# EAGLE board OpenBook (EAGLE 9.7.0)
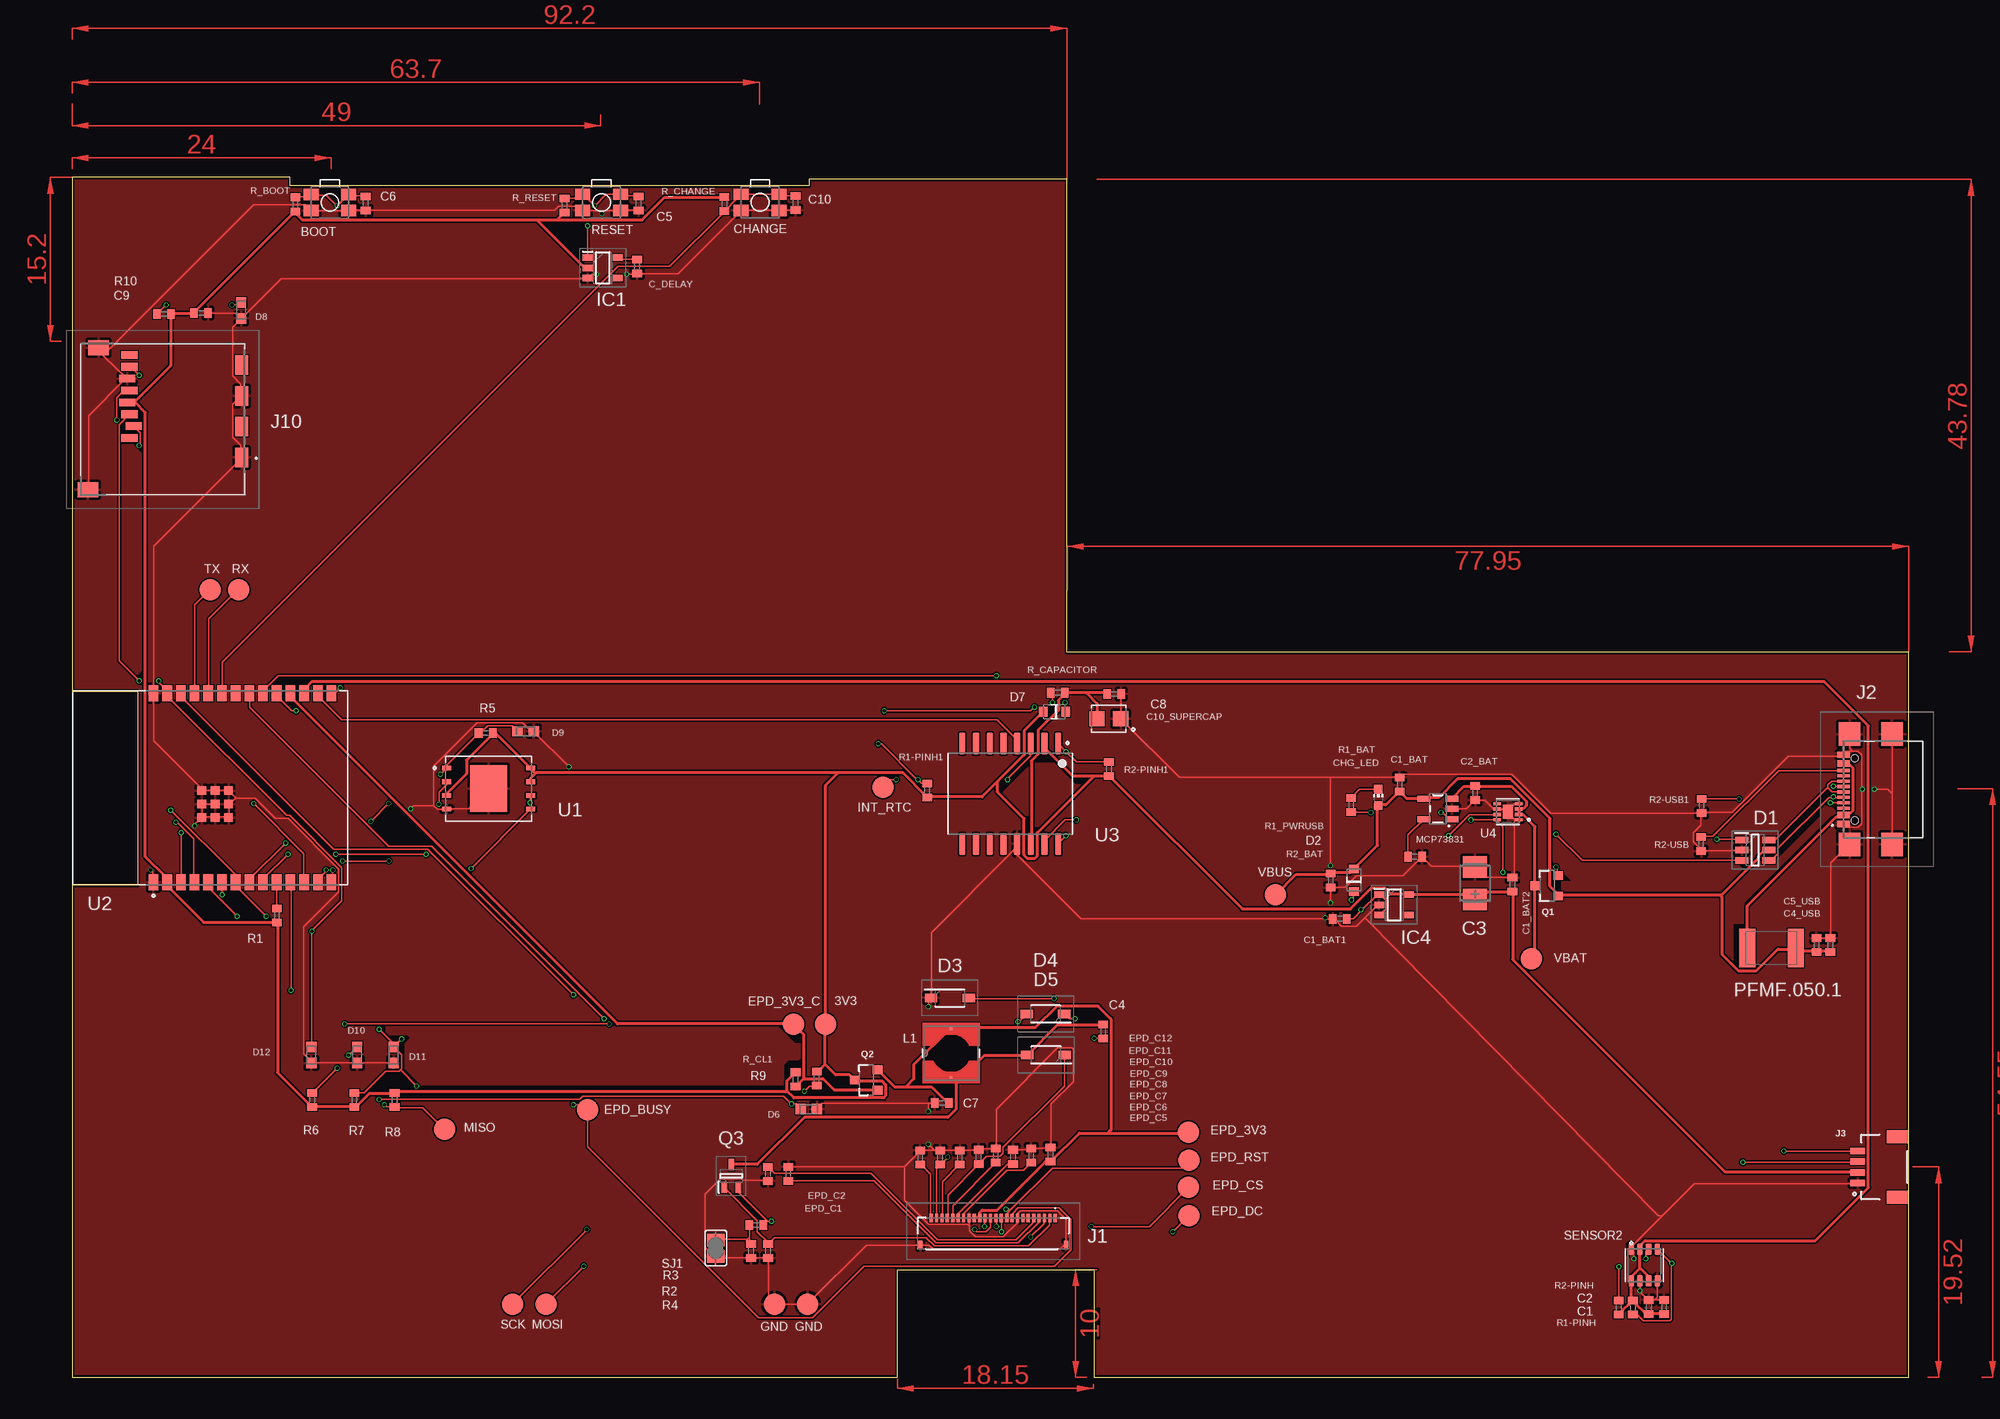
[diagram p1: board, top side]
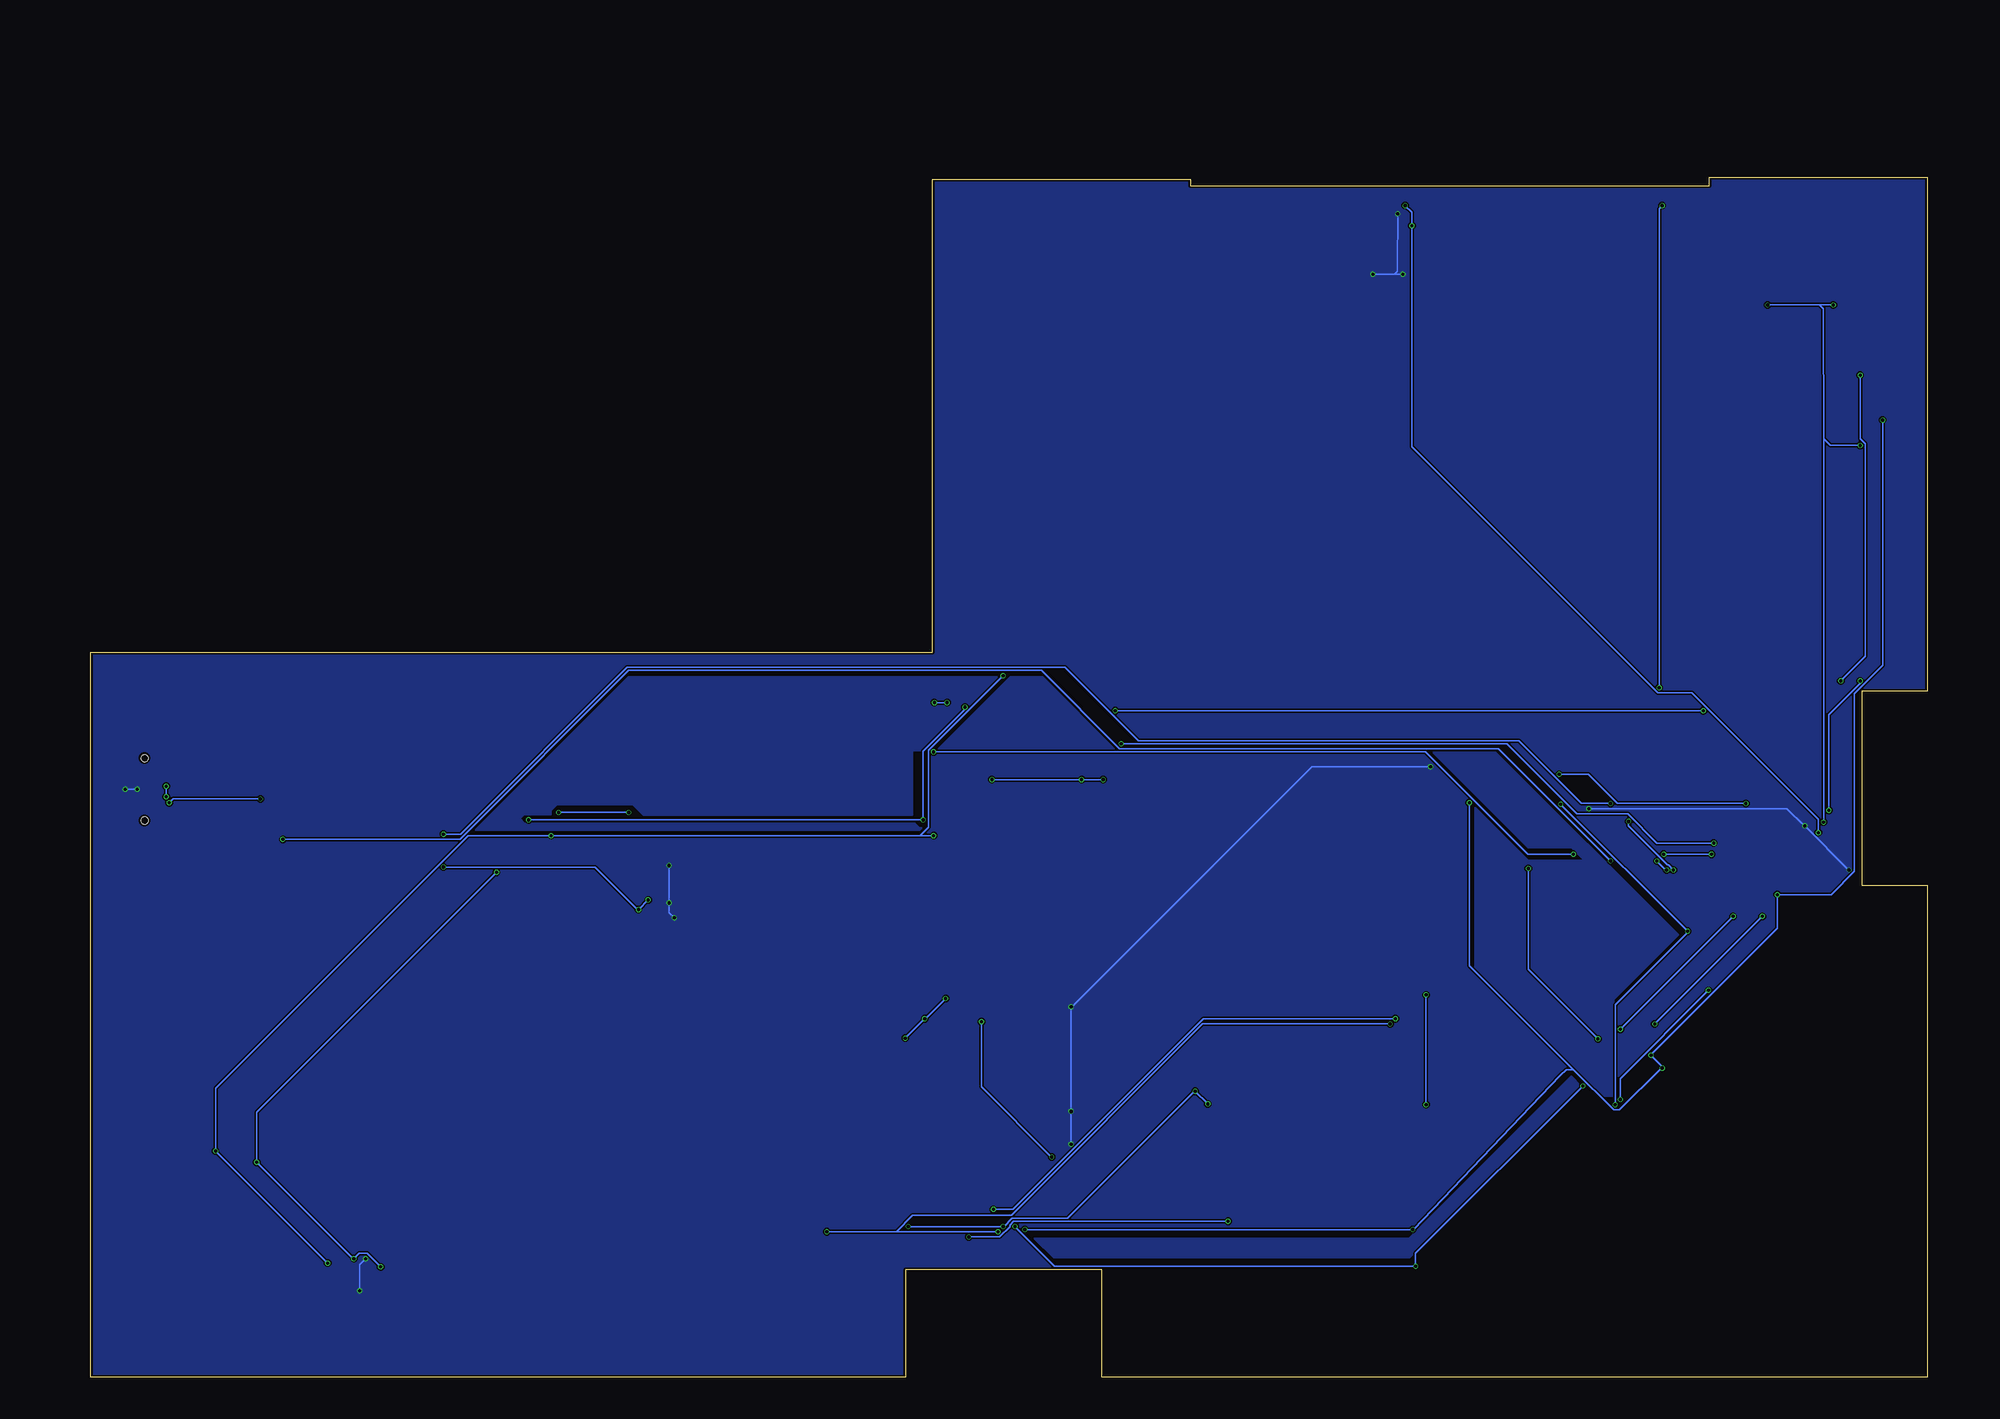
[diagram p2: board, bottom side, seen from below]

Size 170.2 x 111.2 mm. Coordinates in mm from the lower left corner, seen from the top.
Outline: 0,0 76.5,0 76.5,10 94.7,10 94.7,0 170.2,0 170.2,67.2 92.2,67.2 92.2,111 68.3,111 68.3,110.4 20.2,110.4 20.2,111.2 0,111.2 0,63.6 6.1,63.6 6.1,45.6 0,45.6 0,0
Copper layers (1*16): Top 0.035mm / dielectric 1.6mm / Bottom 0.035mm
Design rules "jlcpcb-2layers.dru *": minimum track width 5mil, minimum drill 0.3mm, track to track 5mil, track to pad 5mil, pad to pad 5mil, via to via 5mil, smd to smd 5mil, copper to edge 0.2mm, drill to drill 6mil, minimum pad ring 10mil, minimum via ring 3mil, stop-mask expansion 4mil, vias tented up to drill 0mil, thermal gap 10mil
Net classes: 0 default: width 0.15 mm; 1 power: width 0.3 mm; 2 rest: width 0.15 mm

## Footprints (pad centres in the part's own frame; a part is rotated, then mirrored left to right if it is on the bottom)
MYBUTTON = smd 1.4 x 1.05: 1 1.75,0.75; 2 -1.75,0.75; 3 -1.75,-0.75; 4 1.75,-0.75
EAGLE-LTSPICE_C0402 = smd 0.7 x 0.9: 1 -0.65,0; 2 0.65,0
RCL_CT3528 = smd 2 x 2.2: + -1.5,0; - 1.5,0
CAPCP3225X100N = smd 1.4 x 1.4: 1 -1.1,0; 2 1.1,0
ADAFRUIT_CHIP-LED0603 = smd 0.8 x 0.8: A 0,-0.75; C 0,0.75
SOT95P280X145-6N = smd 1.2 x 0.6: 1 -1.25,0.95; 2 -1.25,0; 3 -1.25,-0.95; 4 1.25,-0.95; 5 1.25,0; 6 1.25,0.95
ESP32_WROVER_AVX---SD0805S020S1R0_AVX_SD0805S020S1R0_0 = smd 0.8 x 0.9: 1 -1.05,0; 2 1.05,0
SOD3716X135N = smd 1.15 x 0.8: 1 -1.75,0; 2 1.75,0
DIOC1608X36N = smd 0.97 x 0.94: 1 -0.75,0; 2 0.75,0
SOT95P280X125-5N = smd 0.9 x 0.6: 1 -1.4,0.95; 2 -1.4,0; 3 -1.4,-0.95; 4 1.4,-0.95; 5 1.4,0.95
SOT95P280X120-5N = smd 0.9 x 0.6: 1 -1.4,0.95; 2 -1.4,0; 3 -1.4,-0.95; 4 1.4,-0.95; 5 1.4,0.95
FH34SRJ24S05SH99 = smd 0.3 x 0.8: 1 5.75,1.45; 2 5.25,1.45; 3 4.75,1.45; 4 4.25,1.45; 5 3.75,1.45; 6 3.25,1.45; 7 2.75,1.45; 8 2.25,1.45; 9 1.75,1.45; 10 1.25,1.45; 11 0.75,1.45; 12 0.25,1.45; 13 -0.25,1.45; 14 -0.75,1.45; 15 -1.25,1.45; 16 -1.75,1.45; 17 -2.25,1.45; 18 -2.75,1.45; 19 -3.25,1.45; 20 -3.75,1.45; 21 -4.25,1.45; 22 -4.75,1.45; 23 -5.25,1.45; 24 -5.75,1.45 | smd 0.4 x 0.8: MP1 6.75,-1.05; MP2 -6.75,-1.05
SAMACSYS_PARTS_USB4110GFA = smd 0.3 x 1.15: A1 -3.35,3.678; A4 -2.55,3.678; A5 -1.25,3.678; A6 -0.25,3.678; A7 0.25,3.678; A8 1.25,3.678; A9 2.55,3.678; A12 3.35,3.678; B1 3.05,3.678; B4 2.25,3.678; B5 1.75,3.678; B6 0.75,3.678; B7 -0.75,3.678; B8 -1.75,3.678; B9 -2.25,3.678; B12 -3.05,3.678 | smd 2.18 x 2: MP1 -5.11,-0.827; MP2 5.11,-0.827; MP3 -5.11,3.103; MP4 5.11,3.103 | hole 0.65: -2.89,2.603; 2.89,2.603
JST04_1MM_RA = smd 0.6 x 1.35: 1 -1.5,0; 2 -0.5,0; 3 0.5,0; 4 1.5,0 | smd 1.2 x 2: NC1 2.8,-3.675; NC2 -2.8,-3.675
112ATAARR03ATTEND = smd 1.8 x 1.2: G1 10.6,10.4; G2 4.9,10.4; S1 7.75,10.4; S2 2.05,10.4 | smd 1.4 x 1.9: G3 13.6,-3.85; G4 0.45,-2.85 | smd 0.7 x 1.5: P1 8.8,0; P2 7.7,0.4; P3 6.6,0; P4 5.5,-0.2; P5 4.4,0; P6 3.3,-0.2; P7 2.2,0; P8 1.1,0
IND_4828-WE-TPC_WRE = smd 0.3 x 0.3: 1 -2.286,0; 2 2.286,0
ESP32_WROVER_SPARKFUN-IC-POWER_SOT23-5 = smd 0.55 x 1.2: 1 -0.95,-1.3; 2 0,-1.3; 3 0.95,-1.3; 4 0.95,1.3; 5 -0.95,1.3
ESP32C6_VARISTOR_CT/CN1812 = smd 1.5 x 3.6: 1 -2.25,0; 2 2.25,0
ESP32_WROVER_SPARKFUN-DISCRETESEMI_SOT23-3 = smd 0.8 x 0.9: 1 -0.95,-1; 2 0.95,-1; 3 0,1.1
SOT65P210X110-3N = smd 1.05 x 0.5: 1 -1.05,0.65; 2 -1.05,-0.65; 3 1.05,0
ESP32_WROVER_EAGLE-LTSPICE_R0402 = smd 0.7 x 0.9: 1 -0.65,0; 2 0.65,0
ESP32_WROVER_BME680_PSON80P300X300X100-8N = smd 1.016 x 0.5: 1 1.458,1.2; 2 1.458,0.4; 3 1.458,-0.4; 4 1.458,-1.2; 5 -1.458,-1.22; 6 -1.458,-0.4; 7 -1.458,0.4; 8 -1.458,1.2
SJ = smd 1.168 x 1.6: 1 -0.762,0; 2 0.762,0
TP20R = smd 2 x 2: TP 0,0
SON127P600X800X80-9N = smd 0.94 x 0.44: 1 -3.895,1.905; 2 -3.895,0.635; 3 -3.895,-0.635; 4 -3.895,-1.905; 5 3.895,-1.905; 6 3.895,-0.635; 7 3.895,0.635; 8 3.895,1.905 | smd 3.4 x 4.3: 9 0,0
XCVR_ESP32-C6-WROOM-1-N8 = smd 1.5 x 0.9: 1 -8.75,5.26; 2 -8.75,3.99; 3 -8.75,2.72; 4 -8.75,1.45; 5 -8.75,0.18; 6 -8.75,-1.09; 7 -8.75,-2.36; 8 -8.75,-3.63; 9 -8.75,-4.9; 10 -8.75,-6.17; 11 -8.75,-7.44; 12 -8.75,-8.71; 13 -8.75,-9.98; 14 -8.75,-11.25; 15 8.75,-11.25; 16 8.75,-9.98; 17 8.75,-8.71; 18 8.75,-7.44; 19 8.75,-6.17; 20 8.75,-4.9; 21 8.75,-3.63; 22 8.75,-2.36; 23 8.75,-1.09; 24 8.75,0.18; 25 8.75,1.45; 26 8.75,2.72; 27 8.75,3.99; 28 8.75,5.26 | smd 0.8 x 0.8: 29_1 -2.755,0.79; 29_2 -1.505,0.79; 29_3 -0.255,0.79; 29_4 -2.755,-0.46; 29_5 -1.505,-0.46; 29_6 -0.255,-0.46; 29_7 -2.755,-1.71; 29_8 -1.505,-1.71; 29_9 -0.255,-1.71
SOIC127P1032X265-16N = smd 2.05 x 0.59: 1 -4.655,4.445; 2 -4.655,3.175; 3 -4.655,1.905; 4 -4.655,0.635; 5 -4.655,-0.635; 6 -4.655,-1.905; 7 -4.655,-3.175; 8 -4.655,-4.445; 9 4.655,-4.445; 10 4.655,-3.175; 11 4.655,-1.905; 12 4.655,-0.635; 13 4.655,0.635; 14 4.655,1.905; 15 4.655,3.175; 16 4.655,4.445
SON50P200X200X80-9N = smd 0.76 x 0.27: 1 -0.985,0.75; 4 -0.985,-0.75; 5 0.985,-0.75; 6 0.985,-0.25; 7 0.985,0.25; 8 0.985,0.75 | smd 0.76 x 0.3: 2 -0.985,0.25; 3 -0.985,-0.25 | smd 0.9 x 1.3: 9 0,0

## Placement (x,y rotation side)
BOOT_BUTTON  BUTTON_CUSYOMV1  [MYBUTTON]  23.9,108.87 180 top
C1  100nF  [EAGLE-LTSPICE_C0402]  147.54,6.53 90 top
C1_BAT  4.7uF  [EAGLE-LTSPICE_C0402]  123.03,54.95 90 top
C1_BAT1  4.7uF  [EAGLE-LTSPICE_C0402]  117.49,42.49 180 top
C1_BAT2  4.7uF  [EAGLE-LTSPICE_C0402]  133.48,45.67 90 top
C2  100nF  [EAGLE-LTSPICE_C0402]  146.12,6.53 90 top
C2_BAT  4.7uF  [EAGLE-LTSPICE_C0402]  130.04,54.15 270 top
C3  100uF TANT  [RCL_CT3528]  130.01,45.8 90 top
C4  4.7uF/25V  [EAGLE-LTSPICE_C0402]  95.56,32.04 90 top
C4_USB  100nF  [EAGLE-LTSPICE_C0402]  162.95,40.07 90 top
C5  1uF  [EAGLE-LTSPICE_C0402]  52.5,108.79 270 top
C5_USB  4.7uF  [EAGLE-LTSPICE_C0402]  161.67,40.07 90 top
C6  100nF  [EAGLE-LTSPICE_C0402]  27.22,108.79 270 top
C7  10uF  [EAGLE-LTSPICE_C0402]  80.59,25.43 180 top
C8  100nF  [EAGLE-LTSPICE_C0402]  96.58,63.33 0 top
C9  100nF  [EAGLE-LTSPICE_C0402]  11.96,98.63 0 top
C10  100nF  [EAGLE-LTSPICE_C0402]  67.05,108.81 270 top
C10_SUPERCAP  CPH3225A  [CAPCP3225X100N]  96.09,61.04 180 top
C_DELAY  100nF  [EAGLE-LTSPICE_C0402]  52.36,102.93 270 top
CHANGE_BUTTON  BUTTON_CUSYOMV1  [MYBUTTON]  63.76,108.89 180 top
CHG_LED  SMD-LED0603  [ADAFRUIT_CHIP-LED0603]  121.06,53.75 0 top
D1  USBLC6-2SC6Y  [SOT95P280X145-6N]  155.98,48.87 0 top
D2  ESP32_WROVER_AVX---SD0805S020S1R0_AVX_SD0805S020S1R0_0_0AVX_SD0805S020S1R0_0_0  [ESP32_WROVER_AVX---SD0805S020S1R0_AVX_SD0805S020S1R0_0]  118.79,46.08 90 top
D3  MBR0530  [SOD3716X135N]  81.36,35.17 0 top
D4  MBR0530  [SOD3716X135N]  90.22,33.68 180 top
D5  MBR0530  [SOD3716X135N]  90.26,29.88 180 top
D6  PGB1010603MR  [DIOC1608X36N]  68.28,24.87 180 top
D7  ESP32_WROVER_AVX---SD0805S020S1R0_AVX_SD0805S020S1R0_0_0AVX_SD0805S020S1R0_0_0  [ESP32_WROVER_AVX---SD0805S020S1R0_AVX_SD0805S020S1R0_0]  91.04,61.68 180 top
D8  PGB1010603MR  [DIOC1608X36N]  15.66,98.87 90 top
D9  PGB1010603MR  [DIOC1608X36N]  42.04,59.87 180 top
D10  PGB1010603MR  [DIOC1608X36N]  26.42,29.87 90 top
D11  PGB1010603MR  [DIOC1608X36N]  29.8,29.87 90 top
D12  PGB1010603MR  [DIOC1608X36N]  22.18,29.87 90 top
EPD_C1  1uF/50V  [EAGLE-LTSPICE_C0402]  66.38,18.87 90 top
EPD_C2  1uF/50V  [EAGLE-LTSPICE_C0402]  64.49,18.87 270 top
EPD_C5  1uF/50V  [EAGLE-LTSPICE_C0402]  90.68,20.65 90 top
EPD_C6  1uF/50V  [EAGLE-LTSPICE_C0402]  88.89,20.55 90 top
EPD_C7  1uF/50V  [EAGLE-LTSPICE_C0402]  87.2,20.45 90 top
EPD_C8  1uF/50V  [EAGLE-LTSPICE_C0402]  85.61,20.55 90 top
EPD_C9  1uF/50V  [EAGLE-LTSPICE_C0402]  84.02,20.45 90 top
EPD_C10  1uF/50V  [EAGLE-LTSPICE_C0402]  82.27,20.39 90 top
EPD_C11  1uF/50V  [EAGLE-LTSPICE_C0402]  80.45,20.39 90 top
EPD_C12  1uF/50V  [EAGLE-LTSPICE_C0402]  78.61,20.39 90 top
IC1  BD5229G-TR  [SOT95P280X125-5N]  49.18,102.81 0 top
IC4  XC6220A331MR-G  [SOT95P280X120-5N]  122.53,43.79 0 top
J1  FH34SRJ-24S-0.5SH_99_  [FH34SRJ24S05SH99]  85.37,13.34 0 top
J2  SAMACSYS_PARTS_USB4110-GF-A  [SAMACSYS_PARTS_USB4110GFA]  167.84,54.5 90 top
J3  QWIIC_RIGHT_ANGLE  [JST04_1MM_RA]  165.49,19.5 90 top
J10  112A-TAAR-R03_ATTEND  [112ATAARR03ATTEND]  5.32,95.85 270 top
L1  68uH  [IND_4828-WE-TPC_WRE]  81.47,30.05 90 top
MCP73831  ESP32_WROVER_SPARKFUN-IC-POWER_MCP73831  [ESP32_WROVER_SPARKFUN-IC-POWER_SOT23-5]  126.58,52.69 90 top
PFMF.050.1  ESP32C6_VARISTORCN1812  [ESP32C6_VARISTOR_CT/CN1812]  157.51,39.8 0 top
Q1  20V/4.2A/52mΩ/1.4W  [ESP32_WROVER_SPARKFUN-DISCRETESEMI_SOT23-3]  136.72,45.56 90 top
Q2  20V/4.2A/52mΩ/1.4W  [ESP32_WROVER_SPARKFUN-DISCRETESEMI_SOT23-3]  73.64,27.56 90 top
Q3  SI1308EDL-T1-GE3  [SOT65P210X110-3N]  61.09,18.68 90 top
R1  10k  [ESP32_WROVER_EAGLE-LTSPICE_R0402]  18.99,42.81 270 top
R1-PINH  10k  [ESP32_WROVER_EAGLE-LTSPICE_R0402]  143.34,6.47 270 top
R1-PINH1  10k  [ESP32_WROVER_EAGLE-LTSPICE_R0402]  79.25,54.39 270 top
R1_BAT  200  [ESP32_WROVER_EAGLE-LTSPICE_R0402]  118.55,53.05 270 top
R1_PWRUSB  100k  [ESP32_WROVER_EAGLE-LTSPICE_R0402]  116.65,46.04 90 top
R2  2.2  [ESP32_WROVER_EAGLE-LTSPICE_R0402]  62.93,11.71 90 top
R2-PINH  10k  [ESP32_WROVER_EAGLE-LTSPICE_R0402]  144.65,6.47 90 top
R2-PINH1  10k  [ESP32_WROVER_EAGLE-LTSPICE_R0402]  96.09,56.39 270 top
R2-USB  5k1  [ESP32_WROVER_EAGLE-LTSPICE_R0402]  150.98,49.43 270 top
R2-USB1  5k1  [ESP32_WROVER_EAGLE-LTSPICE_R0402]  151.02,52.97 90 top
R2_BAT  2k  [ESP32_WROVER_EAGLE-LTSPICE_R0402]  124.46,48.25 180 top
R3  0.47  [ESP32_WROVER_EAGLE-LTSPICE_R0402]  63.41,14.13 0 top
R4  10k  [ESP32_WROVER_EAGLE-LTSPICE_R0402]  64.51,11.71 90 top
R5  10k  [ESP32_WROVER_EAGLE-LTSPICE_R0402]  38.33,59.71 0 top
R6  10k  [ESP32_WROVER_EAGLE-LTSPICE_R0402]  22.25,25.71 270 top
R7  10k  [ESP32_WROVER_EAGLE-LTSPICE_R0402]  26.17,25.71 270 top
R8  10k  [ESP32_WROVER_EAGLE-LTSPICE_R0402]  29.89,25.71 90 top
R9  10k  [ESP32_WROVER_EAGLE-LTSPICE_R0402]  69.01,27.71 90 top
R10  10k  [ESP32_WROVER_EAGLE-LTSPICE_R0402]  8.53,98.53 0 top
R_BOOT  10k  [ESP32_WROVER_EAGLE-LTSPICE_R0402]  20.7,108.7 270 top
R_CAPACITOR  15  [ESP32_WROVER_EAGLE-LTSPICE_R0402]  91.35,63.44 0 top
R_CHANGE  10k  [ESP32_WROVER_EAGLE-LTSPICE_R0402]  60.46,108.71 90 top
R_CL1  10k  [ESP32_WROVER_EAGLE-LTSPICE_R0402]  67.06,27.63 90 top
R_RESET  10k  [ESP32_WROVER_EAGLE-LTSPICE_R0402]  45.64,108.6 270 top
RESET_BUTTON  BUTTON_CUSYOMV1  [MYBUTTON]  49.07,108.88 180 top
SENSOR2  BME688  [ESP32_WROVER_BME680_PSON80P300X300X100-8N]  145.71,10.42 90 top
SJ1  1m  [SJ]  59.66,11.99 90 top
TP1  TPTP20R  [TP20R]  12.8,72.99 0 top
TP2  TPTP20R  [TP20R]  15.43,72.99 0 top
TP3  TPTP20R  [TP20R]  135.25,38.79 0 top
TP4  TPTP20R  [TP20R]  68.17,6.79 0 top
TP5  TPTP20R  [TP20R]  65.09,6.79 0 top
TP6  TPTP20R  [TP20R]  34.51,22.99 0 top
TP7  TPTP20R  [TP20R]  43.93,6.79 0 top
TP8  TPTP20R  [TP20R]  40.85,6.79 0 top
TP9  TPTP20R  [TP20R]  47.77,24.79 0 top
TP10  TPTP20R  [TP20R]  103.48,17.61 0 top
TP11  TPTP20R  [TP20R]  103.49,14.99 0 top
TP12  TPTP20R  [TP20R]  103.53,20.11 0 top
TP13  TPTP20R  [TP20R]  66.88,32.71 0 top
TP14  TPTP20R  [TP20R]  111.53,44.71 0 top
TP15  TPTP20R  [TP20R]  75.18,54.71 0 top
TP16  TPTP20R  [TP20R]  69.83,32.71 0 top
TP17  TPTP20R  [TP20R]  103.48,22.71 0 top
U1  W25Q512JVEIQ  [SON127P600X800X80-9N]  38.61,54.56 0 top
U2  ESP32-C6-WROOM-1-N8  [XCVR_ESP32-C6-WROOM-1-N8]  12.8,54.64 90 top
U3  DS3231SN#  [SOIC127P1032X265-16N]  86.95,54.1 270 top
U4  MAX17048G+T10  [SON50P200X200X80-9N]  133.07,52.42 180 top

## Tracks (layer width: path | path; a pad name or v marks a point on that pad's centre or on a via)
3V3
  Top 0.3: 43.07,107.27 47.51,102.84 47.71,102.84 IC1.2 | 43.07,107.27 45,107.27 | 45,107.27 52.84,107.27 54.91,109.35 60.45,109.35 R_CHANGE.2 | 5.75,90.37 5.12,90.37 J10.P4 | 5.75,90.37 9.14,93.76 9.14,98.4 R10.2 9.21,98.54 11.22,98.54 11.29,98.61 C9.1 11.36,98.75 20.64,108.03 R_BOOT.2 20.71,107.89 21.33,107.27 43.07,107.27 | J3.2 165.44,19.04 153.18,19.04 133.51,38.71 133.51,44.87 C1_BAT2.1 133.44,45.01 130.74,45.01 130.12,44.39 C3.+ 129.98,44.32 129.57,44.74 123.96,44.74 IC4.5 123.82,44.8 122.23,44.8 121.67,45.36 120.43,45.36 118.49,43.42 108.44,43.42 96.19,55.68 R2-PINH1.2 96.05,55.75 94.73,55.75 | R_CL1.2 66.27,27.49 66.27,26.52 | 66.27,26.52 66.89,25.9 75.21,25.9 75.41,26.11 75.41,27.15 75.07,27.49 72.57,27.49 Q2.3 72.44,27.63 72.03,28.03 70.77,28.03 69.8,29 | R9.2 69.04,28.32 69.13,28.32 69.8,29 | 69.8,29 69.8,32.69 TP16.TP 69.83,54.85 71,56.02 | U1.3 34.76,53.95 34.76,54.15 36.56,55.95 36.56,57.2 38.92,59.55 R5.2 38.99,59.69 39.27,59.69 42.45,56.51 U1.8 42.52,56.37 42.87,56.02 43,56.02 | 94.73,55.75 92.73,55.75 90.16,58.31 90.16,58.72 U3.2 | 85.77,55.23 88.22,57.69 88.22,59.9 89.96,61.63 D7.2 | 85.77,55.23 84.35,53.81 79.29,53.81 R1-PINH1.2 79.15,53.88 77.01,56.02 71,56.02 | 94.73,55.75 89.47,50.48 89.47,48.34 89.26,48.13 88.5,48.13 88.22,48.41 88.22,51.78 85.77,54.23 85.77,55.23 | 71,56.02 43,56.02 | 66.27,26.52 66.13,26.45 29.98,26.45 R8.2 29.85,26.32 27.56,26.32 26.32,25.07 R7.2 26.11,25.07 22.3,25.07 R6.2 22.16,25.14 19.04,28.25 19.04,42.03 R1.2 18.97,42.17 12.19,42.17 8.86,45.5 8.86,45.84 U2.2 8.73,45.98 8.73,46.33 6.79,48.27 6.79,89.4 5.89,90.3 5.75,90.37
  Top 0.3: 45,107.27 45,107.31 R_RESET.2 | U1.7 42.51,55.53 43,56.02
32KHZ  (via drill 0.3)
  Top 0.15: 92.14,58 91.41,58.72 U3.1 | 92.14,58 93.07,57.06 96.05,57.06 R2-PINH1.1 | v20.01,48.48 17.73,46.19 17.73,45.91 U2.9 | v32.83,48.48 v24.45,48.48 | v92.1,57.96 92.14,58
  Bottom 0.15: v24.45,48.48 v20.01,48.48 | v32.83,48.48 37.05,48.48 46.54,57.96 v92.1,57.96
DN  (via drill 0.3)
  Top 0.15: 163.22,53.74 162.81,53.74 158.1,49.03 158.1,48.54 157.47,47.92 157.27,47.92 D1.4 | 163.22,53.74 164.12,53.74 J2.B7 | v163.22,54.78 164.12,54.78 J2.A7 | 163.22,53.74 v163.22,53.81
  Bottom 0.15: v163.22,53.81 v163.22,54.78
DP
  Top 0.15: 162.74,54.64 163.08,54.29 164.12,54.29 J2.A6 | 162.74,54.64 162.74,54.91 163.08,55.26 164.12,55.26 J2.B6 | D1.6 157.27,49.86 157.89,49.86 162.67,54.64 162.74,54.64
EPD_3V3
  Top 0.3: 77.27,26.94 76.24,26.94 74.65,28.53 Q2.2 | 77.27,26.94 79.64,26.94 81.09,25.48 81.23,25.48 C7.1 | J1.16 83.65,14.82 84.07,14.82 J1.15 84.14,14.96 84.14,15.3 84.35,15.51 85.73,15.51 90.16,19.94 90.65,19.94 EPD_C5.1 90.79,20.08 93.35,22.64 96,22.64 | 96,22.64 103.46,22.64 TP17.TP | 77.27,26.94 78,27.67 78,29 78.03,29 81.3,32.27 81.44,32.27 L1.2 81.58,32.41 89.26,32.41 91.27,34.42 95.08,34.42 96.25,33.25 96.25,33.19 96.29,33.16 96.29,22.93 96,22.64
EPD_3V3_C
  Top 0.3: 67.8,27.7 67.1,27.01 R_CL1.1 | 67.8,27.7 67.8,31.79 66.89,32.69 TP13.TP 66.76,32.76 50.55,32.76 20.29,63.02 20.29,63.36 U2.18 | 67.8,27.7 69.6,27.7 70.64,26.66 74.58,26.66 Q2.1
EPD_BUSY  (via drill 0.3)
  Top 0.15: J1.9 87.19,14.82 87.19,15.23 87.67,15.72 91.48,15.72 92.59,14.61 92.59,11.84 91.06,10.32 73.41,10.32 68.63,5.54 63.64,5.54 47.78,21.4 47.78,24.72 TP9.TP 47.71,24.79 47.23,25.28 v46.47,25.28 | v46.47,35.46 32.96,48.96 24.24,48.96 10.11,63.09 10.11,63.36 U2.26
  Bottom 0.15: v46.47,25.28 v46.47,35.46
EPD_CS  (via drill 0.3)
  Top 0.15: v85.66,13.99 85.66,14.75 J1.12 | v94.46,13.99 99.86,13.99 TP10.TP | v67.86,26.52 68.35,27.01 68.97,27.01 R9.1 | D6.2 67.52,24.93 67.1,25.35 v66.69,25.35 66.62,25.35 65.93,26.04 47.3,26.04 47.02,25.76 v28.46,25.76 | v20.29,35.87 20.29,45.84 U2.11
  Bottom 0.15: v94.46,13.99 v85.66,13.99 85.59,13.99 84.83,14.75 79.71,14.75 67.93,26.52 v67.86,26.52 v66.69,25.35 | v20.29,35.87 28.46,27.7 v28.46,25.76
EPD_DC  (via drill 0.3)
  Top 0.15: v86.15,13.5 86.15,14.75 J1.11 | v102,13.5 103.46,14.96 TP11.TP | v15.3,42.73 12.67,45.36 12.67,45.84 U2.5 | v49.79,32.76 v25.28,32.76
  Bottom 0.15: v102,13.5 95.58,13.5 95.56,13.5 | 95.56,13.5 v86.15,13.5 | v25.28,32.76 v15.3,42.73 | v49.79,32.76 67.17,32.76 84.9,15.03 94.04,15.03 95.56,13.5
EPD_RST  (via drill 0.3)
  Top 0.15: 87.04,15.57 90.86,19.39 102.84,19.39 103.53,20.08 TP12.TP | 87.04,15.57 86.63,15.17 86.63,14.82 J1.10 | v49.31,33.24 33.31,49.24 29.36,49.24 16.48,62.12 16.48,63.36 U2.21 | v86.56,15.58 87.03,15.58 87.04,15.57
  Bottom 0.15: v49.31,33.24 67.1,33.24 84.76,15.58 v86.56,15.58
FLASH_CS  (via drill 0.3)
  Top 0.15: D9.2 41.27,59.9 40.79,60.39 38.5,60.39 37.88,59.76 37.74,59.76 R5.1 37.67,59.69 34.76,56.78 34.76,56.51 U1.1 34.69,56.44 v34.14,55.88 | v16.83,53.18 21.47,48.54 21.47,45.91 U2.12
  Bottom 0.15: v16.83,53.18 28.74,53.18 31.44,55.88 v34.14,55.88
GDR
  Top 0.15: J1.2 90.58,14.75 90.58,14.13 88.64,12.19 79.92,12.19 79.15,12.95 65.09,12.95 64.54,12.4 R4.2 64.54,12.46 63.5,13.5 63.5,14.54 60.45,17.59 Q3.1
GND  (via drill 0.3)
  Top 0.15: J10.G3 1.52,82.27 1.52,89.12 4.99,92.59 J10.P6 5.05,92.59 4.57,93.07 4.5,93.07 2.49,95.08 2.49,95.36 J10.G4 2.91,94.73 16.83,108.65 21.61,108.65 22.09,108.17 BOOT_BUTTON.1 22.16,108.1 25.62,108.1 BOOT_BUTTON.2 25.69,108.17 27.21,108.17 C6.2 27.29,108.17 44.74,108.17 45.08,108.52 46.95,108.52 47.3,108.17 RESET_BUTTON.1 47.37,108.1 49.1,108.1 | C5.2 52.49,108.17 50.83,108.17 RESET_BUTTON.2 50.76,108.1 49.1,108.1 | U1.9 38.57,54.5 36.77,52.7 34.76,52.7 U1.4 34.69,52.63 33.86,52.63 33.52,52.98 | 33.52,52.98 33.52,56.65 37.53,60.66 41.76,60.66 42.52,59.9 42.73,59.9 D9.1 42.8,59.83 v46.05,56.58 | D11.1 29.78,29.15 26.45,29.15 D10.1 26.38,29.15 22.23,29.15 D12.1 22.23,29.22 21.47,29.98 21.47,41.76 24.72,45.01 24.72,47.09 20.01,51.8 18.84,51.8 16.97,53.67 15.17,53.67 | U2.29_1 12.05,51.94 12.05,53.12 U2.29_2 12.12,53.12 13.23,53.12 U2.29_5 | U2.29_1 12.12,51.94 13.23,51.94 U2.29_4 13.3,51.94 14.47,51.94 U2.29_7 14.54,51.94 14.54,53.12 U2.29_8 14.61,53.12 15.17,53.67 | v7.27,47.02 7.48,46.81 7.48,45.91 U2.1 | v11.36,51.11 11.36,51.24 11.98,51.87 U2.29_1 | 15.17,53.67 15.17,53.74 14.54,54.36 U2.29_9 14.47,54.43 13.3,54.43 U2.29_6 13.23,54.43 12.05,54.43 U2.29_3 12.05,54.5 7.55,59 7.55,63.36 U2.28 7.55,63.43 7.55,77.01 15.72,85.18 J10.G1 15.65,85.32 15.65,86.36 14.89,87.12 14.89,90.16 15.65,90.92 J10.G2 15.65,91 15.65,92.03 14.89,92.8 14.89,97.3 15.65,98.06 D8.1 | 33.52,52.98 31.65,52.98 v31.37,52.7 | C10.2 67.03,108.17 65.51,108.17 CHANGE_BUTTON.2 65.44,108.17 62.05,108.17 CHANGE_BUTTON.1 61.98,108.1 56.16,102.28 52.42,102.28 C_DELAY.2 52.35,102.21 v51.38,102.21
  Top 0.15: C9.2 12.67,98.61 15.17,98.61 D8.1 | D8.1 15.72,98.13 19.39,101.8 47.71,101.8 IC1.3 47.85,101.87 48.2,102.21 v48.61,102.21 | v49.1,107.82 49.1,108.1 | EPD_C2.2 64.47,18.28 62.19,18.28 62.05,18.42 60.11,18.42 58.66,16.97 58.66,12.05 59.42,11.29 59.62,11.29 SJ1.1 59.69,11.22 59.83,11.08 62.88,11.08 R2.1 62.95,11.08 64.47,11.08 R4.1 64.54,11.01 64.54,7.34 65.03,6.86 TP5.TP 68.14,6.79 TP4.TP 68.21,6.86 73.61,12.26 78.6,12.26 J1.MP2 78.67,12.26 79.43,12.26 79.78,11.91 91.62,11.91 92.03,12.33 J1.MP1 92.1,12.33 92.1,14.68 91.34,15.44 87.88,15.44 87.67,15.23 87.67,14.82 J1.8 87.6,14.75 87.6,14.34 86.28,13.02 83.72,13.02 83.17,13.57 83.17,14 | 79.36,25.41 69.53,25.41 69.04,24.93 D6.1 | 79.36,25.41 79.92,25.41 C7.2 | 83.17,14 83.17,14.75 J1.17 | EPD_C7.2 87.25,21.12 88.78,21.12 88.85,21.19 EPD_C6.2 88.92,21.26 90.65,21.26 EPD_C5.2 90.72,21.33 90.72,25.35 92.8,27.42 92.8,30.4 92.66,30.54 91.34,30.54 85.66,24.86 85.66,21.26 EPD_C8.2 85.59,21.19 84.14,21.19 84.07,21.12 EPD_C9.2 84,21.05 82.34,21.05 EPD_C10.2 82.2,21.05 80.47,21.05 EPD_C11.2 80.4,21.05 79.92,21.05 | 77.14,19.53 66.41,19.53 EPD_C1.2 | 77.14,19.53 78.6,20.98 EPD_C12.2 78.67,21.05 79.92,21.05 | 77.14,19.53 77.14,16.41 79.28,14.28 79.3,14.28 79.39,14.19 82.98,14.19 83.17,14 | v79.36,24.65 79.36,25.41 | 168.69,54.1 168.69,59.55 J2.MP2 | 168.69,54.1 168.69,49.44 J2.MP1 | D1.2 154.7,48.82 151.03,48.82 R2-USB.2 151.03,48.89 150.27,49.65 150.27,50.48 150.97,51.18 150.97,52.28 R2-USB1.1 | 164.19,57.82 164.19,57.62 J2.B1 164.12,57.55 159.07,57.55 153.87,52.35 151.03,52.35 R2-USB1.1
  Top 0.15: 164.19,57.82 J2.A12 | C5_USB.2 161.7,40.72 C4_USB.2 163.01,40.79 163.01,47.71 164.68,49.38 J2.MP3 164.68,49.44 164.19,49.93 164.19,50.97 | J2.B12 164.19,51.38 164.19,51.18 J2.A1 164.19,51.11 164.19,50.97 | 165,58.03 165.51,58.03 165.85,57.69 165.85,54.5 | 165.85,54.5 165.85,51.31 165.51,50.97 164.19,50.97 | v165.92,54.5 165.85,54.5 | 116.62,55.61 102.63,55.61 97.23,61.01 C10_SUPERCAP.1 97.23,61.08 97.23,63.29 C8.2 | 116.62,55.61 122.99,55.61 C1_BAT.2 123.06,55.61 123.33,55.88 133.44,55.88 137.05,52.28 150.9,52.28 R2-USB1.1 | 146.7,7.2 147.5,7.2 C1.2 | 146.7,7.2 146.19,7.2 C2.2 146.05,7.2 145.36,7.89 145.36,8.03 | 145.36,8.03 145.36,8.93 SENSOR2.7 | 147.4,14.99 150.34,17.94 165.44,17.94 J3.1 | 147.4,14.99 144.53,12.12 144.53,11.91 SENSOR2.1 144.53,11.84 144.73,11.63 v144.73,11.01 | v145.29,8.03 145.36,8.03 | 133.65,51.73 134,51.73 U4.1 | 133.65,51.73 133.03,52.35 U4.9 | U4.9 132.96,52.35 132.68,52.63 132.13,52.63 U4.6 132.06,52.7 131.71,52.7 130.95,53.46 130.05,53.46 C2_BAT.2 129.98,53.46 129.22,52.7 127.91,52.7 MCP73831.2 | U4.4 134,53.12 133.65,53.12 132.96,52.42 U4.9 | 133.65,51.73 133.65,46.6 133.44,46.4 C1_BAT2.2 133.44,46.33 131.02,46.33 130.05,47.3 C3.- 129.98,47.37 125.97,47.37 125.14,48.2 R2_BAT.1 125.07,48.2 123.33,46.47 119.04,46.47 118,45.43 116.69,45.43 R1_PWRUSB.1 116.62,45.36 v116.62,43.97 | 119.8,42.59 120.98,43.77 121.12,43.77 IC4.2 | 119.8,42.59 119.04,41.83 117.66,41.83 117.03,42.45 116.89,42.45 C1_BAT1.2 116.83,42.52 116.13,42.52 | 87.22,48.79 87.53,49.1 87.53,49.44 U3.13 | 87.22,48.79 79.64,41.2 79.64,35.18 D3.1 79.57,35.11 79.36,34.9 v79.36,34.35
  Top 0.15: 116.13,42.52 93.49,42.52 87.22,48.79 | v116.13,42.59 116.13,42.52 | 119.8,42.59 147,15 147.01,14.99 147.4,14.99 | v116.62,47.44 116.62,55.61 | v79.36,21.61 79.92,21.05 | SENSOR2.5 146.93,7.43 146.7,7.2 | v167.03,54.5 168.29,54.5 168.69,54.1 | J2.MP4 164.73,58.3 165,58.03 | 165,58.03 164.4,58.03 164.19,57.82
  Bottom 0.15: v7.27,47.02 v11.36,51.11 11.43,51.11 13.02,52.7 v31.37,52.7 | v48.61,102.21 49.4,102.21 | 49.4,102.21 v51.38,102.21 | v49.1,107.82 49.1,103 49.1,102.51 49.4,102.21 | v79.36,21.61 v79.36,24.65 v79.36,34.35 79.29,34.35 57.06,56.58 v46.05,56.58 | v165.92,54.5 v167.03,54.5 | v145.29,8.03 145.29,10.46 v144.73,11.01 | v116.13,42.59 116.62,43.07 v116.62,43.97 v116.62,47.44
  pour Top: 6.16,45.56 6.14,45.54 6.12,45.52 0.08,45.52 0.08,0.08 76.42,0.08 76.42,10.02 76.44,10.04 76.46,10.06 76.48,10.08 94.72,10.08 94.74,10.06 94.76,10.04 94.78,10.02 94.78,0.08 170.12,0.08 170.12,67.12 92.18,67.12 92.16,67.14 92.14,67.16 92.12,67.18 92.12,110.92 68.38,110.92 68.38,110.38 68.36,110.36 68.34,110.34 68.32,110.32 20.18,110.32 20.16,110.34 20.14,110.36 20.12,110.38 20.12,111.12 0.08,111.12 0.08,63.68 6.12,63.68 6.14,63.66 6.16,63.64 6.18,63.62 6.18,45.58
  pour Bottom: 6.16,45.56 6.14,45.54 6.12,45.52 0.08,45.52 0.08,0.08 76.42,0.08 76.42,10.02 76.44,10.04 76.46,10.06 76.48,10.08 94.72,10.08 94.74,10.06 94.76,10.04 94.78,10.02 94.78,0.08 170.12,0.08 170.12,67.12 92.18,67.12 92.16,67.14 92.14,67.16 92.12,67.18 92.12,110.92 68.38,110.92 68.38,110.38 68.36,110.36 68.34,110.34 68.32,110.32 20.18,110.32 20.16,110.34 20.14,110.36 20.12,110.38 20.12,111.12 0.08,111.12 0.08,63.68 6.12,63.68 6.14,63.66 6.16,63.64 6.18,63.62 6.18,45.58
  pour Bottom: 29.06,35.04 29.08,35.02 29.08,26.08 29.97,26.08 41.92,38.03 41.92,52.82 37.04,47.94 37.02,47.92 31.98,47.92 31.96,47.94 31.94,47.96 31.92,47.98 31.92,48.02 31.94,48.04 32.96,49.06 32.98,49.08 36.97,49.08 45.82,57.92 40.03,57.92 23.11,41
  pour Bottom: 80.97,11.08 82.82,12.92 47.98,12.92 47.96,12.94 33,27.89 32.11,27 48.03,11.08
  pour Bottom: 75.18,58.08 91.82,58.08 84.97,64.92 82.03,64.92
  pour Bottom: 93.88,51.34 93.47,50.94 93.45,50.92 93.18,50.92 93.42,50.69 134.6,50.69 120.36,64.92 86.18,64.92 93.03,58.08 94.02,58.08 94.04,58.06 94.06,58.04 94.08,58.02 94.08,52.08 118.97,52.08 119.96,53.06 119.98,53.08 127.02,53.08 127.04,53.06 127.54,52.56 127.56,52.54 127.56,52.16 130.1,52.16 130.12,52.14 130.43,51.83 130.45,51.81 130.45,51.77 130.43,51.75 130.04,51.36 130.02,51.34
  pour Top: 4.66,66.49 6.02,65.13 6.46,65.57 6.46,85.55 5.61,86.4 4.66,86.4
  pour Top: 25.55,52.72 16,62.27 16,62.26 11.52,62.26 11.52,62.19 24.51,49.2 25.54,49.2 25.55,49.21
  pour Top: 28.92,53.97 21.97,60.92 20.77,60.92 20.75,60.94 19.32,62.36 17.07,62.36 17.08,62.03 27.03,52.08 27.97,52.08 28.92,53.03
  pour Top: 31.32,31.37 31.3,31.35 30.86,30.9 30.86,28.67 32.41,27.12 65.92,27.12 65.92,29.02 65.94,29.04 66.34,29.44 66.36,29.46 67.27,29.46 67.45,29.64 67.45,30.92 66.98,30.92 66.96,30.94 65.39,32.5 29.1,32.5 29.1,32.05 29.38,31.77 31.13,31.77 31.15,31.75 31.3,31.6 31.32,31.58
  pour Top: 89.97,51.08 93.82,54.92 92.98,54.92 92.96,54.94 90.97,56.92 89.08,56.92 89.08,51.08
  pour Top: 88.03,52.08 88.92,52.08 88.92,56.82 86.11,54
  pour Top: 139.06,45.96 139.04,45.94 139.02,45.92 138.08,45.92 138.08,45.08 152.97,45.08 154.89,47 153.97,47.92 139.98,47.92 139.96,47.94 137.97,49.92 137.08,49.92 137.08,48.03 139.06,46.04 139.08,46.02 139.08,45.98
  pour Top: 162.06,51.96 158.04,47.94 158.02,47.92 156.03,47.92 153.08,44.97 153.08,39.03 153.92,38.18 153.92,42.02 153.94,42.04 153.96,42.06 153.98,42.08 154.92,42.08 154.92,44.02 154.94,44.04 162.96,52.06 162.98,52.08 163.82,52.08 162.97,52.92 162.08,52.92 162.08,51.98
GPIO8
  Top 0.15: R1.1 18.97,43.49 18.97,45.84 U2.10
I2C_PW
  Top 0.3: C1.1 147.5,5.89 146.19,5.89 C2.1 145.98,5.89 145.84,5.89 144.73,6.99 R2-PINH.2 | R1-PINH.2 143.35,5.89 144.59,7.13 R2-PINH.2 | R2-PINH.2 144.53,7.27 144.53,8.93 SENSOR2.8 144.59,9.07 144.59,9.42 145.29,10.11 | 145.29,10.11 145.29,11.84 SENSOR2.2 145.43,11.98 145.43,12.33 145.77,12.67 161.56,12.67 166.48,17.59 166.48,60.39 162.39,64.47 22.23,64.47 21.54,63.78 21.54,63.43 U2.17 | SENSOR2.6 146.05,9 146.05,9.42 145.43,10.04 145.29,10.11
INT_RTC  (via drill 0.3)
  Top 0.15: v76.38,55.4 75.83,55.4 75.21,54.78 TP15.TP | R1-PINH1.1 79.22,55.05 78.74,55.05 v78.39,55.4 78.32,55.4 75,58.72 v74.72,58.72 | v19.8,49.51 16.48,46.19 16.48,45.91 U2.8 | v86.7,55.4 86.7,55.47 88.85,57.62 88.85,58.72 U3.3
  Bottom 0.15: v76.38,55.4 v78.39,55.4 v86.7,55.4 | v19.8,49.51 25.07,49.51 27.77,52.22 32.48,52.22 38.99,58.72 v74.72,58.72
IO/BOOT  (via drill 0.3)
  Top 0.15: R_BOOT.1 20.71,109.42 21.95,109.42 22.09,109.55 BOOT_BUTTON.4 22.16,109.55 23.55,109.55 24.52,108.58 v24.58,108.58 25.62,109.62 BOOT_BUTTON.3 25.69,109.55 25.76,109.48 27.21,109.48 C6.1 | v24.86,63.92 24.38,63.43 24.1,63.43 U2.15
  Bottom 0.15: v24.86,63.92 24.86,108.31 v24.58,108.58
IO/CHANGE
  Top 0.15: C10.1 67.03,109.48 65.65,109.48 65.51,109.62 CHANGE_BUTTON.3 65.44,109.62 62.05,109.62 CHANGE_BUTTON.4 61.98,109.62 61.08,108.72 61.08,108.65 60.52,108.1 R_CHANGE.1 60.45,108.03 55.4,102.97 50.62,102.97 13.92,66.27 13.92,63.43 U2.23
MISO  (via drill 0.3)
  Top 0.15: TP6.TP 34.49,22.99 32.48,25 29.92,25 R8.1 29.85,25.07 29.15,25.07 v28.95,25.28 | v34,53.12 34,54.22 34.69,54.91 34.69,55.19 U1.2 | D12.2 22.23,30.68 v22.23,41.34 22.23,41.41 25,44.18 25,47.23 20.15,52.08 19.88,52.08 8.86,63.09 8.86,63.36 U2.27 8.79,63.43 8.79,63.64 8.03,64.4 v8.03,64.54 | v6.23,92.86 5.47,93.63 5.33,93.63 J10.P7
  Bottom 0.15: v34,53.12 v22.23,41.34 22.23,41.27 28.95,34.56 v28.95,25.28 | v6.23,92.86 6.23,86.98 5.75,86.49 5.75,66.83 v8.03,64.54
MOSI  (via drill 0.3)
  Top 0.15: v84.55,13.99 84.55,14.75 J1.14 | v47.44,10.32 43.97,6.86 TP7.TP | 30.43,28.5 30.54,28.6 30.54,29.92 29.85,30.61 D11.2 | 30.43,28.5 30.33,28.39 29.09,28.39 27.08,26.38 26.18,26.38 R7.1 | v36.98,47.16 42.45,52.63 U1.5 | v30.54,31.37 29.85,30.68 D11.2 | v18,42.73 15.17,45.57 15.17,45.84 U2.7 15.1,45.91 15.1,46.6 v9.14,52.56 | v28.46,32.27 29.92,30.82 D11.2 | v6.23,64.54 4.36,66.41 4.36,88.29 5.26,89.19 J10.P3 | 30.43,28.5 v31.92,27.01
  Bottom 0.15: v84.55,13.99 80.88,10.32 v47.44,10.32 47.44,11.49 v31.92,27.01 | v36.98,47.16 36.98,37.81 v30.54,31.37 | v28.46,32.27 v18,42.73 | v6.23,64.54 6.23,64.33 9.14,61.42 v9.14,52.56
N$1
  Top 0.15: R2-USB.1 151.03,50.14 152.07,50.14 158.17,56.23 164.12,56.23 J2.B5
N$2  (via drill 0.3)
  Top 0.15: v154.5,53.6 151.03,53.6 R2-USB1.2 | v162.94,53.25 164.12,53.25 J2.A5
  Bottom 0.15: v154.5,53.6 162.6,53.6 v162.94,53.25
N$4
  Top 0.15: CHG_LED.C 119.32,54.5 118.56,53.74 R1_BAT.1
N$5  (via drill 0.3)
  Top 0.15: 119.56,43.32 120.98,44.74 121.12,44.74 IC4.1 121.19,44.8 121.81,44.18 121.81,43.42 121.67,43.28 121.6,43.28 121.19,42.87 IC4.3 | 119.56,43.32 118.76,42.52 118.14,42.52 C1_BAT1.1 | v118.56,44.25 118.76,44.46 118.76,45.01 D2.1 | v119.46,43.35 119.53,43.35 119.56,43.32 | v137.53,47.3 137.67,47.16 137.67,46.54 Q1.2
  Bottom 0.15: v118.56,44.25 v119.46,43.35 119.53,43.35 123.47,47.3 v137.53,47.3
N$6  (via drill 0.3)
  Top 0.15: v94.73,31.44 95.5,31.44 C4.1 | v92.93,33.24 92.45,33.24 92.03,33.66 D4.1 | v91,35.11 83.17,35.11 D3.2
  Bottom 0.15: v94.73,31.44 v92.93,33.24 92.86,33.24 v91,35.11
N$7  (via drill 0.3)
  Top 0.15: v120.36,52.35 118.56,52.35 R1_BAT.2 | v126.87,52.35 127,52.35 127.56,51.8 127.83,51.8 MCP73831.1
  Bottom 0.15: v126.87,52.35 v120.36,52.35
N$8
  Top 0.15: R2_BAT.2 123.82,48.27 123.82,50.28 MCP73831.5
N$9
  Top 0.15: J1.24 79.57,14.82 79.57,18.84 78.67,19.74 EPD_C12.1
N$11
  Top 0.15: J1.22 80.68,14.82 80.68,18.14 EPD_C10.1
N$13
  Top 0.15: J1.20 81.65,14.82 81.65,15.93 85.59,19.88 EPD_C8.1
N$14
  Top 0.15: J1.19 82.13,14.82 82.13,15.17 86.7,19.74 87.19,19.74 EPD_C7.1
N$15
  Top 0.15: J1.18 82.68,14.82 82.68,15.23 86.63,19.18 88.16,19.18 88.85,19.88 EPD_C6.1
N$22
  Top 0.15: J1.5 89.06,14.75 89.06,14.34 87.46,12.74 80.19,12.74 74.03,18.91 65.09,18.91 64.54,19.46 EPD_C2.1
N$23
  Top 0.15: J1.4 89.61,14.75 89.61,14.4 87.67,12.46 80.05,12.46 74.31,18.21 66.41,18.21 EPD_C1.1
N$26
  Top 0.15: C_DELAY.1 52.35,103.6 50.76,103.6 50.62,103.74 IC1.5
N$32  (via drill 0.3)
  Top 0.15: v92.03,62.53 92.03,61.7 D7.1 | v90.86,62.53 90.86,63.29 90.72,63.43 R_CAPACITOR.1
  Bottom 0.15: v90.86,62.53 v92.03,62.53
PREVGH
  Top 0.15: J1.21 81.16,14.82 81.16,16.9 84,19.74 EPD_C9.1 84.07,19.8 84.76,20.5 86.01,20.5 86.28,20.77 86.28,21.33 91.96,27.01 91.96,29.85 D5.1
PREVGL  (via drill 0.3)
  Top 0.15: J1.23 80.12,14.82 80.12,19.46 80.4,19.74 EPD_C11.1 80.47,19.74 v81.16,20.43 | v87.67,32.96 87.74,32.96 88.43,33.66 D4.2
  Bottom 0.15: v87.67,32.96 87.67,26.94 v81.16,20.43
RESE  (via drill 0.3)
  Top 0.15: v88.85,13.02 90.09,14.27 90.09,14.75 J1.3 | v64.82,14.47 64.4,14.47 64.13,14.2 R3.2 64.4,14.54 61.77,17.17 61.77,17.59 Q3.2
  Bottom 0.15: v88.85,13.02 86.01,13.02 85.04,13.99 85.04,14.13 84.69,14.47 v64.82,14.47
RESE'
  Top 0.15: 62.81,13 62.81,12.46 62.88,12.4 R2.2 | 62.81,13 62.81,14.13 R3.1 | SJ1.2 59.69,12.81 62.62,12.81 62.81,13
RESET  (via drill 0.3)
  Top 0.15: C5.1 52.49,109.48 50.97,109.48 RESET_BUTTON.3 50.76,109.62 49.51,109.62 48.48,108.58 v48.41,108.58 47.37,109.62 RESET_BUTTON.4 47.3,109.62 46.95,109.28 45.7,109.28 R_RESET.1 | v47.78,106.71 47.78,103.81 IC1.1 | v10.11,50.48 10.11,45.91 U2.3
  Bottom 0.15: v48.41,108.58 47.78,107.96 v47.78,106.71 47.78,86.22 25,63.43 21.81,63.43 10.11,51.73 v10.11,50.48
RTC_RST
  Top 0.15: U2.16 22.78,63.36 22.78,63.16 25,60.94 85.73,60.94 87.53,59.14 87.53,58.79 U3.4
RX
  Top 0.15: U2.24 12.67,63.43 12.67,70.29 15.37,72.99 TP2.TP
SCK  (via drill 0.3)
  Top 0.15: v83.65,13.71 83.86,13.5 84.69,13.5 85.11,13.92 85.11,14.75 J1.13 | v47.71,13.71 40.86,6.86 TP8.TP | v24.58,28.67 22.3,26.38 R6.1 | v25.62,29.85 26.38,30.61 D10.2 | v42.45,53.25 42.45,53.88 U1.6 | v13.92,44.74 13.92,45.84 U2.6 | v4.16,88.71 4.16,90.79 4.78,91.41 5.26,91.41 J10.P5
  Bottom 0.15: v83.65,13.71 v47.71,13.71 47.64,13.71 34,28 33.47,28.53 32.83,28.53 | v42.45,53.25 42.45,38.16 32.83,28.53 | 32.83,28.53 29.09,24.79 28.53,24.79 24.65,28.67 v24.58,28.67 24.58,28.81 v25.62,29.85 25.62,29.92 13.92,41.62 v13.92,44.74 8.93,44.74 6.79,46.88 6.79,63.36 4.16,66 v4.16,88.71
SCL  (via drill 0.3)
  Top 0.15: 148.19,10.6 148.19,5.4 148.06,5.26 145.63,5.26 145.08,5.82 144.66,5.82 R2-PINH.1 | 148.19,10.6 146.95,11.84 SENSOR2.4 | v158.65,20.98 165.44,20.98 J3.4 | v148.26,10.6 148.19,10.6 | v127.56,50.21 129.5,52.15 132.06,52.15 U4.7 | v92.1,50.21 91.41,49.51 U3.16 | v85.66,65.03 19.11,65.03 17.73,63.64 17.73,63.43 U2.20
  Bottom 0.15: v148.26,10.6 v158.65,20.98 158.65,26.8 135.25,50.21 v127.56,50.21 93.41,50.21 93.37,50.21 | v92.1,50.21 93.37,50.21 | v85.66,65.03 92.59,58.1 92.58,51 93.37,50.21
SDA  (via drill 0.3)
  Top 0.15: v143.35,10.25 143.35,7.13 R1-PINH.1 | v145.84,11.01 145.84,11.63 146.05,11.84 SENSOR2.3 | v154.84,19.94 165.44,19.94 J3.3 | v129.64,51.66 132.06,51.66 U4.8 132.06,51.59 132.61,51.04 v132.61,46.81 | v93.07,51.66 92.03,51.66 90.16,49.79 90.16,49.51 U3.15 | v20.77,61.77 20.36,61.77 18.97,63.16 18.97,63.36 U2.19 | v75.28,61.77 88.85,61.77 v89.19,62.12
  Bottom 0.15: v143.35,10.25 144.59,11.49 145.36,11.49 v145.84,11.01 145.91,11.01 v154.84,19.94 154.84,24.58 v132.61,46.81 | v129.64,51.66 v93.07,51.66 93.07,58.03 89.19,61.91 v89.19,62.12 | v75.28,61.77 v20.77,61.77
SRC
  Top 0.3: C4.2 95.5,32.69 91.34,32.69 88.57,29.92 D5.2 88.36,29.85 84.55,29.85 82.06,27.35 81.92,27.29 | 81.92,27.29 81.92,24.86 81.16,24.1 67.86,24.1 63.5,19.74 61.15,19.74 Q3.3 | 81.92,27.29 81.51,27.7 L1.1
SS_SD  (via drill 0.3)
  Top 0.15: v8.73,99.37 7.89,98.54 R10.1 | v14.82,99.37 15.44,99.37 15.65,99.58 D8.2 | v9.63,51.45 9.76,51.45 11.29,49.93 11.29,45.91 U2.4 | v6.23,86.36 6.3,86.42 6.3,87.53 5.75,88.09 J10.P2
  Bottom 0.15: v14.82,99.37 10,99.37 | 10,99.37 v8.73,99.37 | 9.63,87 9.63,86.36 v9.63,51.45 | 9.63,87 9.63,98.89 9.63,99 10,99.37 | v6.23,86.36 8.98,86.36 9.63,87
TX
  Top 0.15: U2.25 11.36,63.43 11.36,71.61 12.74,72.99 TP1.TP
USB_D+  (via drill 0.3)
  Top 0.15: v152.42,49.86 154.7,49.86 D1.1 | v25.07,47.85 v29.36,47.85 | v24.17,47.02 24.17,45.98 24.1,45.91 U2.14
  Bottom 0.15: v152.42,49.86 136.01,49.86 120.36,65.51 82.13,65.51 74.86,58.24 39.75,58.24 v29.36,47.85 | v25.07,47.85 24.24,47.02 v24.17,47.02
USB_D-  (via drill 0.3)
  Top 0.15: v137.53,50.34 139.95,47.92 154.7,47.92 D1.3 | v27.7,51.52 v29.36,53.18 | v23.55,47.02 23.55,46.88 22.78,46.12 22.78,45.91 U2.13
  Bottom 0.15: v137.53,50.34 135.94,50.34 120.5,65.79 79.92,65.79 73.13,59 37.88,59 32.06,53.18 v29.36,53.18 | v27.7,51.52 27.7,51.11 24.1,47.51 24.03,47.51 v23.55,47.02
VBAT
  Top 0.3: MCP73831.3 127.91,53.67 129.01,54.78 129.98,54.78 C2_BAT.1 130.19,54.78 133.38,54.78 134.76,53.39 134.76,52.98 134.48,52.7 134.21,52.7 U4.3 134.07,52.63 134.07,52.22 U4.2 134.21,52.15 134.48,52.15 135.59,51.04 135.59,45.7 Q1.3 135.59,45.5 135.59,39.13 135.31,38.85 TP3.TP
VBUS
  Top 0.3: TP14.TP 111.56,44.74 113.43,46.6 116.55,46.6 R1_PWRUSB.2 116.69,46.74 118.42,46.74 118.76,47.09 D2.2 118.9,47.23 120.98,49.31 120.98,52.91 CHG_LED.A 121.12,53.05 121.74,53.05 122.99,54.29 C1_BAT.1 123.13,54.22 123.68,53.67 125.27,53.67 MCP73831.4 125.41,53.74 126.66,53.74 128.39,55.47 133.31,55.47 136.98,51.8 136.98,45.5 137.67,44.8 Q1.1 137.74,44.67 152.84,44.67 | C4_USB.1 162.94,39.47 161.7,39.47 C5_USB.1 161.56,39.54 159.97,39.54 159.76,39.75 PFMF.050.1.2 159.62,39.68 158.1,39.68 156.09,37.67 154.43,37.67 152.9,39.2 152.9,44.53 152.84,44.67 | 152.84,44.67 156.3,48.13 156.3,48.34 156.78,48.82 157.2,48.82 D1.5
VRTC
  Top 0.3: 94,63.43 95.84,63.43 95.91,63.36 C8.1 | 94,63.43 92.03,63.43 R_CAPACITOR.2 91.96,63.29 91.41,62.74 91.41,61.84 89.54,59.97 89.54,57.76 88.92,57.13 88.92,49.51 U3.14 | 94,63.43 94.99,62.44 C10_SUPERCAP.2
VUSB
  Top 0.3: J2.A9 164.19,56.99 164.19,56.78 J2.B4 164.33,56.72 164.81,56.72 165.02,56.51 165.02,52.49 164.81,52.28 164.33,52.28 J2.B9 164.19,52.22 164.19,52.01 J2.A4 164.05,51.94 163.5,51.94 155.26,43.7 155.26,39.82 PFMF.050.1.1
(copper drawn outside any net)
  shapes: Top area x12

## Text on the board
tPlace: BOOT | RESET | CHANGE | TX | RX | INT_RTC | VBUS | U2 | VBAT | EPD_3V3_C | 3V3 | EPD_BUSY | MISO | EPD_3V3 | EPD_RST | EPD_CS | EPD_DC | SCK | MOSI | GND | GND
tNames: L1